# Altium schematic sheet 01_Overview.SchDoc
size 513 x 386 mm
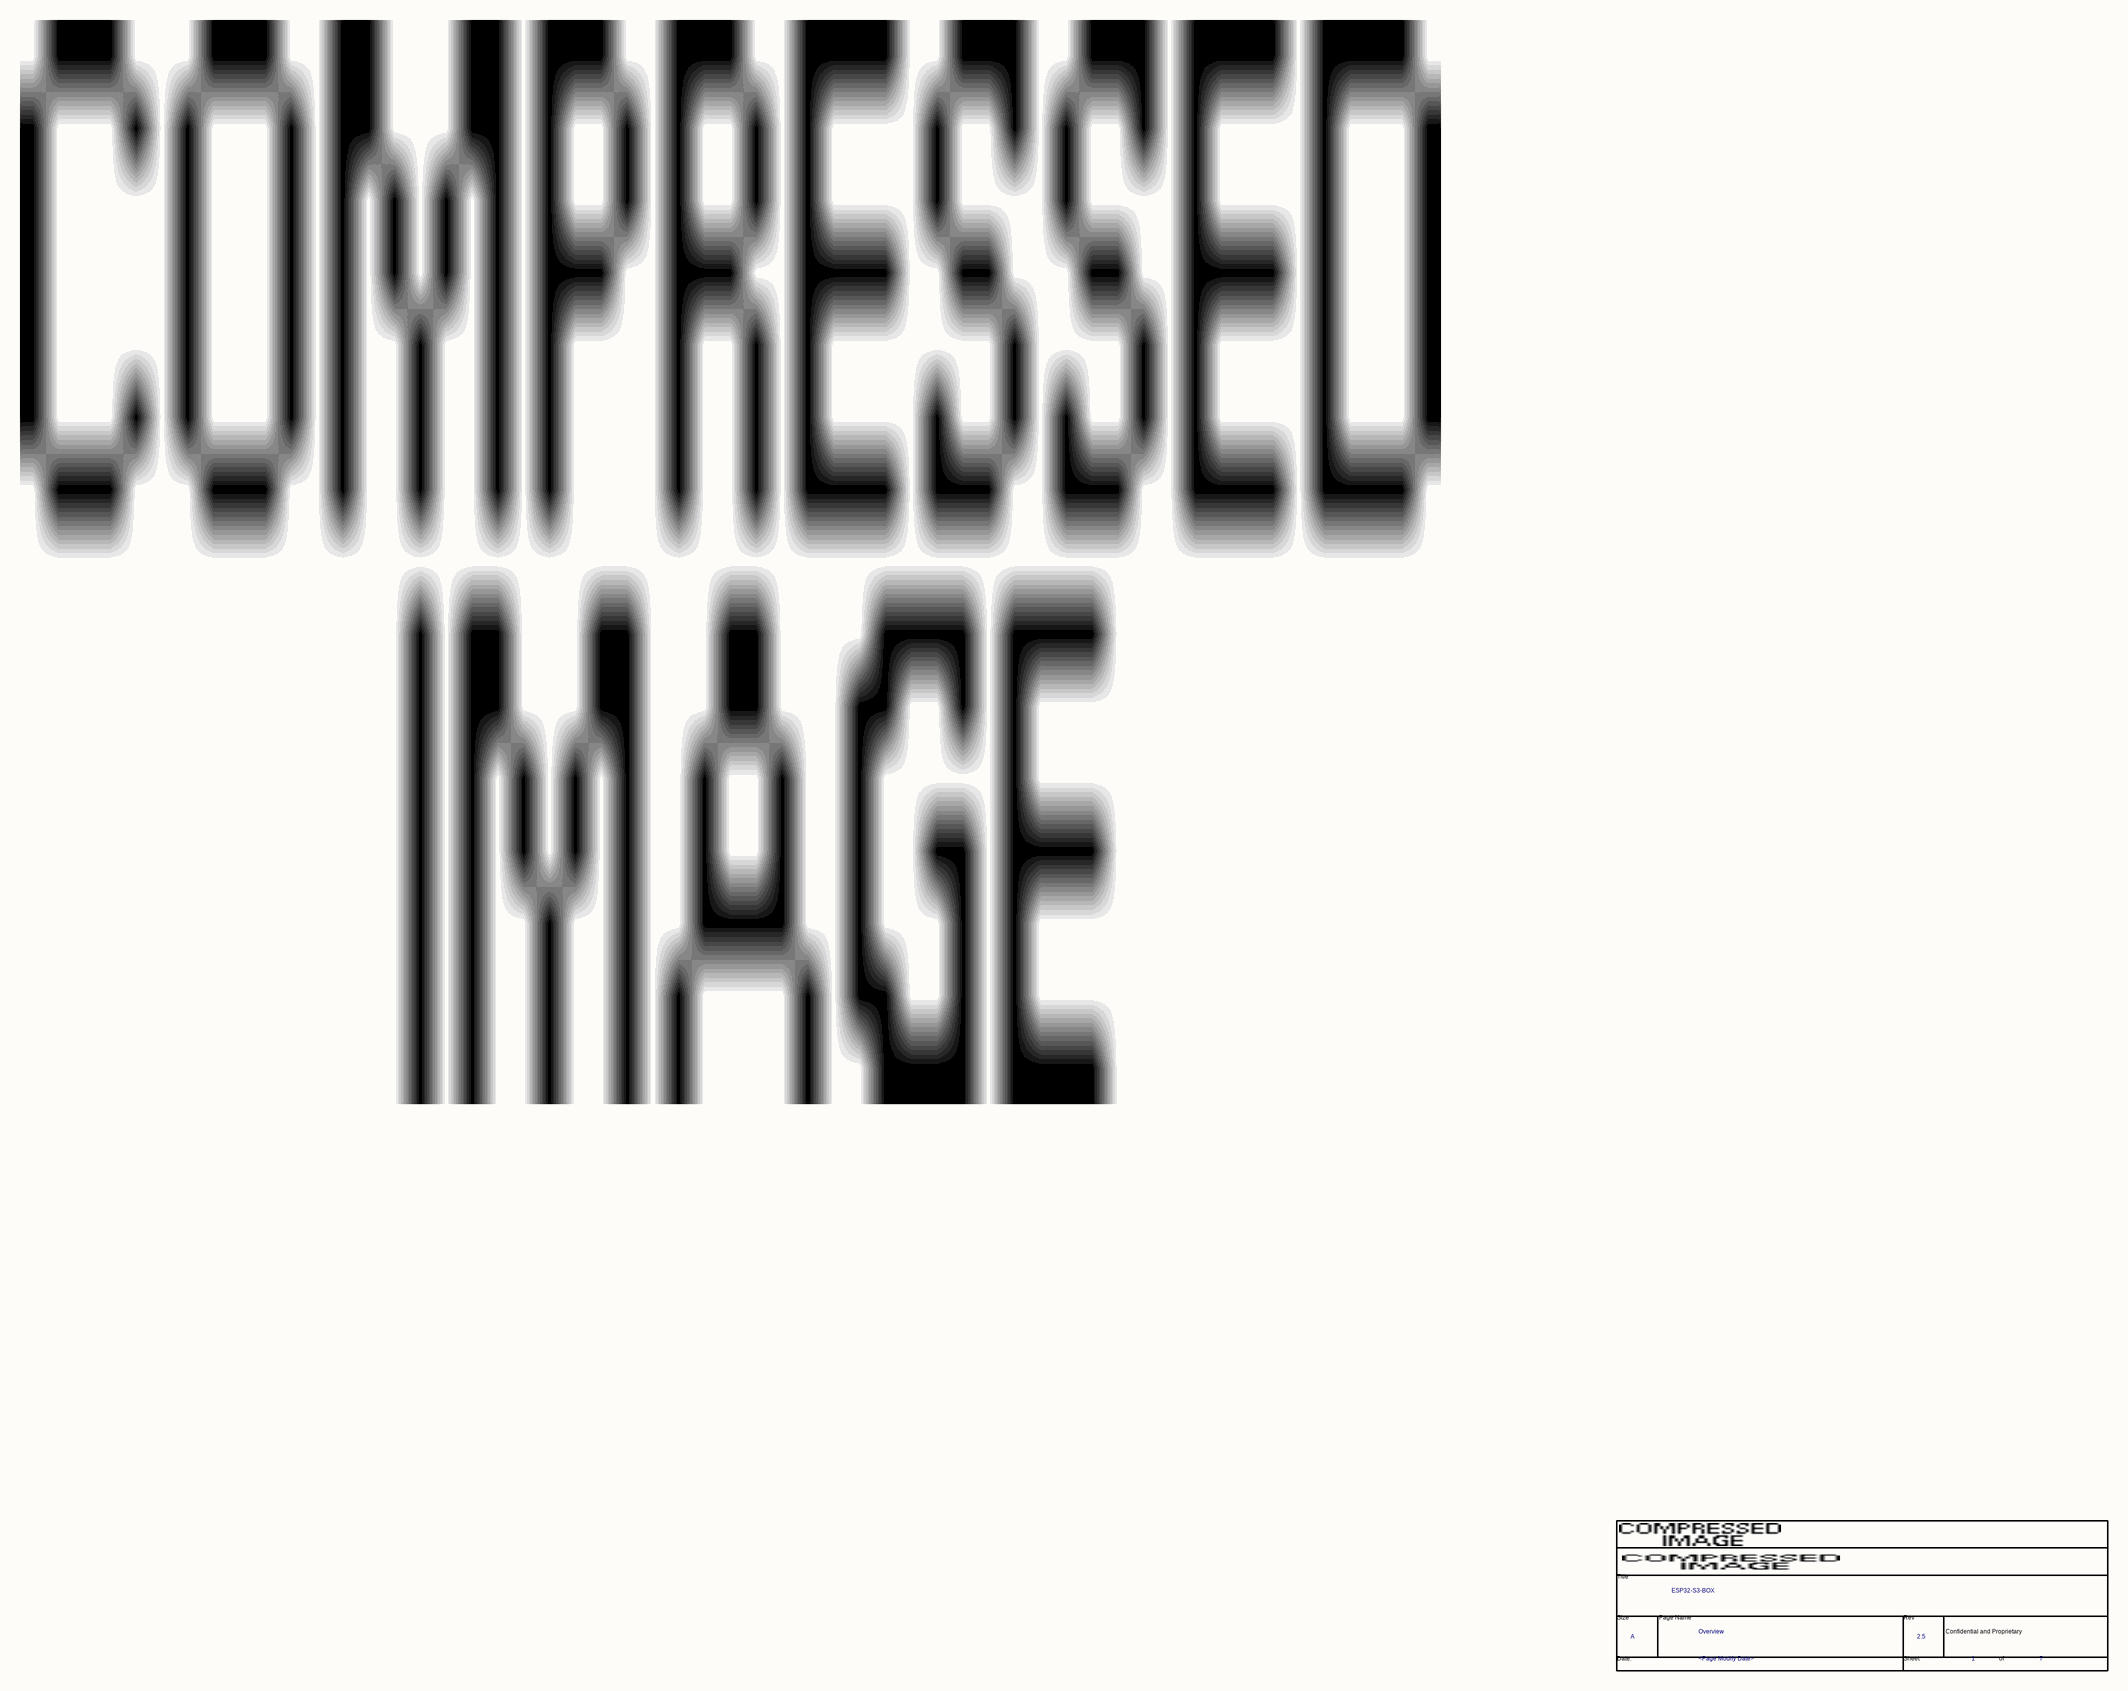
[diagram p0: 01_Overview.SchDoc]

## Parts
*  Page Modify Date: <Page Modify Date>  Page Name: Overview  Title: ESP32-S3-BOX  Page Size: A  Page Number: 1  Page Count: 7  RevCode: 2.5  (hidden comment: espTitleBlock3)  (graphical)

## Notes on the sheet
- (in symbol espTitleBlock3) Title; Size; Page Name; Rev; Confidential and Proprietary; Date:; Sheet; of

## Library data of the parts
* = espTitleBlock3: Doc: ESP32-S3-EYE_V1.0; OrgName: ESPRESSIF